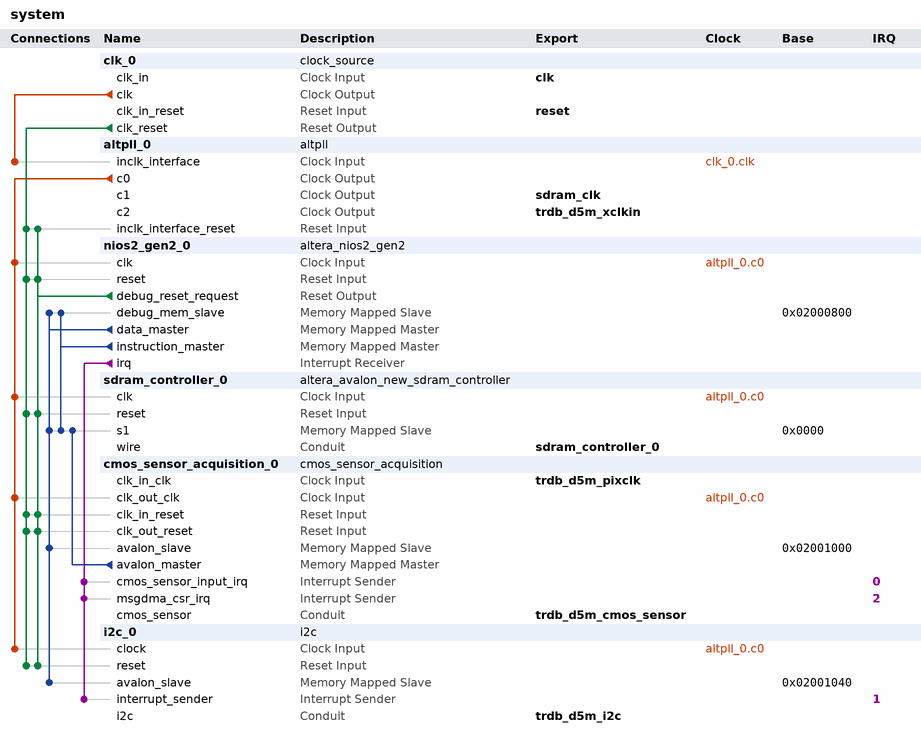
[diagram p0: system contents]
# Platform Designer (Qsys) system system, Cyclone IV E EP4CE22F17C6
# Parameters at their usual value, and those the tool derives, are not listed.
package require -exact qsys 15.1
create_system system
set_project_property DEVICE_FAMILY {Cyclone IV E}
set_project_property DEVICE EP4CE22F17C6

add_instance clk_0 clock_source 15.1
set_instance_parameter_value clk_0 clockFrequency 50000000

add_instance altpll_0 altpll 15.1
set_instance_parameter_value altpll_0 CLK0_DIVIDE_BY 1
set_instance_parameter_value altpll_0 CLK0_MULTIPLY_BY 1
set_instance_parameter_value altpll_0 CLK1_DIVIDE_BY 1
set_instance_parameter_value altpll_0 CLK1_DUTY_CYCLE 50
set_instance_parameter_value altpll_0 CLK1_MULTIPLY_BY 1
set_instance_parameter_value altpll_0 CLK1_PHASE_SHIFT -3000
set_instance_parameter_value altpll_0 CLK2_DIVIDE_BY 5
set_instance_parameter_value altpll_0 CLK2_DUTY_CYCLE 50
set_instance_parameter_value altpll_0 CLK2_MULTIPLY_BY 1
set_instance_parameter_value altpll_0 CLK2_PHASE_SHIFT 0
set_instance_parameter_value altpll_0 INCLK0_INPUT_FREQUENCY 20000
set_instance_parameter_value altpll_0 PORT_ARESET PORT_UNUSED
set_instance_parameter_value altpll_0 PORT_LOCKED PORT_UNUSED
set_instance_parameter_value altpll_0 PORT_clk1 PORT_USED
set_instance_parameter_value altpll_0 PORT_clk2 PORT_USED
set_instance_parameter_value altpll_0 PORT_clk3 PORT_UNUSED

add_instance nios2_gen2_0 altera_nios2_gen2 15.1
set_instance_parameter_value nios2_gen2_0 dcache_size 0
set_instance_parameter_value nios2_gen2_0 exceptionSlave sdram_controller_0.s1
set_instance_parameter_value nios2_gen2_0 icache_size 4096
set_instance_parameter_value nios2_gen2_0 impl Fast
set_instance_parameter_value nios2_gen2_0 resetSlave sdram_controller_0.s1

add_instance sdram_controller_0 altera_avalon_new_sdram_controller 15.1
set_instance_parameter_value sdram_controller_0 TAC 6.5
set_instance_parameter_value sdram_controller_0 TRCD 20.0
set_instance_parameter_value sdram_controller_0 TRP 20.0
set_instance_parameter_value sdram_controller_0 casLatency 2
set_instance_parameter_value sdram_controller_0 columnWidth 9
set_instance_parameter_value sdram_controller_0 dataWidth 16
set_instance_parameter_value sdram_controller_0 generateSimulationModel false
set_instance_parameter_value sdram_controller_0 initRefreshCommands 8
set_instance_parameter_value sdram_controller_0 model single_Micron_MT48LC4M32B2_7_chip
set_instance_parameter_value sdram_controller_0 numberOfBanks 4
set_instance_parameter_value sdram_controller_0 numberOfChipSelects 1
set_instance_parameter_value sdram_controller_0 powerUpDelay 200.0
set_instance_parameter_value sdram_controller_0 refreshPeriod 0.75
set_instance_parameter_value sdram_controller_0 rowWidth 13

add_instance cmos_sensor_acquisition_0 cmos_sensor_acquisition 15.1
set_instance_parameter_value cmos_sensor_acquisition_0 CLK_IN_CLOCK_FREQUENCY 10000000
set_instance_parameter_value cmos_sensor_acquisition_0 CLK_OUT_CLOCK_FREQUENCY 50000000
set_instance_parameter_value cmos_sensor_acquisition_0 CMOS_SENSOR_INPUT_DEBAYER_ENABLE false
set_instance_parameter_value cmos_sensor_acquisition_0 CMOS_SENSOR_INPUT_DEVICE_FAMILY {Cyclone IV E}
set_instance_parameter_value cmos_sensor_acquisition_0 CMOS_SENSOR_INPUT_FIFO_DEPTH 32
set_instance_parameter_value cmos_sensor_acquisition_0 CMOS_SENSOR_INPUT_MAX_HEIGHT 1944
set_instance_parameter_value cmos_sensor_acquisition_0 CMOS_SENSOR_INPUT_MAX_WIDTH 2592
set_instance_parameter_value cmos_sensor_acquisition_0 CMOS_SENSOR_INPUT_OUTPUT_WIDTH 16
set_instance_parameter_value cmos_sensor_acquisition_0 CMOS_SENSOR_INPUT_PACKER_ENABLE false
set_instance_parameter_value cmos_sensor_acquisition_0 CMOS_SENSOR_INPUT_PIX_DEPTH 12
set_instance_parameter_value cmos_sensor_acquisition_0 CMOS_SENSOR_INPUT_SAMPLE_EDGE FALLING
set_instance_parameter_value cmos_sensor_acquisition_0 DC_FIFO_DEPTH 16
set_instance_parameter_value cmos_sensor_acquisition_0 DC_FIFO_WIDTH 32
set_instance_parameter_value cmos_sensor_acquisition_0 MSGDMA_BURST_ENABLE 1
set_instance_parameter_value cmos_sensor_acquisition_0 MSGDMA_DATA_FIFO_DEPTH 64
set_instance_parameter_value cmos_sensor_acquisition_0 MSGDMA_DATA_WIDTH 32
set_instance_parameter_value cmos_sensor_acquisition_0 MSGDMA_DESCRIPTOR_FIFO_DEPTH 8
set_instance_parameter_value cmos_sensor_acquisition_0 MSGDMA_MAX_BURST_COUNT 16
set_instance_parameter_value cmos_sensor_acquisition_0 MSGDMA_MAX_BYTE 8388608

add_instance i2c_0 i2c 15.1

# connections
add_connection altpll_0.c0 cmos_sensor_acquisition_0.clk_out_clk clock
add_connection altpll_0.c0 i2c_0.clock clock
add_connection altpll_0.c0 nios2_gen2_0.clk clock
add_connection altpll_0.c0 sdram_controller_0.clk clock
add_connection clk_0.clk altpll_0.inclk_interface clock
add_connection clk_0.clk_reset altpll_0.inclk_interface_reset reset
add_connection clk_0.clk_reset cmos_sensor_acquisition_0.clk_in_reset reset
add_connection clk_0.clk_reset cmos_sensor_acquisition_0.clk_out_reset reset
add_connection clk_0.clk_reset i2c_0.reset reset
add_connection clk_0.clk_reset nios2_gen2_0.reset reset
add_connection clk_0.clk_reset sdram_controller_0.reset reset
add_connection nios2_gen2_0.debug_reset_request altpll_0.inclk_interface_reset reset
add_connection nios2_gen2_0.debug_reset_request cmos_sensor_acquisition_0.clk_in_reset reset
add_connection nios2_gen2_0.debug_reset_request cmos_sensor_acquisition_0.clk_out_reset reset
add_connection nios2_gen2_0.debug_reset_request i2c_0.reset reset
add_connection nios2_gen2_0.debug_reset_request nios2_gen2_0.reset reset
add_connection nios2_gen2_0.debug_reset_request sdram_controller_0.reset reset
add_connection cmos_sensor_acquisition_0.avalon_master sdram_controller_0.s1 avalon
set_connection_parameter_value cmos_sensor_acquisition_0.avalon_master/sdram_controller_0.s1 baseAddress 0x0000
add_connection nios2_gen2_0.data_master cmos_sensor_acquisition_0.avalon_slave avalon
set_connection_parameter_value nios2_gen2_0.data_master/cmos_sensor_acquisition_0.avalon_slave baseAddress 0x02001000
add_connection nios2_gen2_0.data_master i2c_0.avalon_slave avalon
set_connection_parameter_value nios2_gen2_0.data_master/i2c_0.avalon_slave baseAddress 0x02001040
add_connection nios2_gen2_0.data_master nios2_gen2_0.debug_mem_slave avalon
set_connection_parameter_value nios2_gen2_0.data_master/nios2_gen2_0.debug_mem_slave baseAddress 0x02000800
add_connection nios2_gen2_0.data_master sdram_controller_0.s1 avalon
set_connection_parameter_value nios2_gen2_0.data_master/sdram_controller_0.s1 baseAddress 0x0000
add_connection nios2_gen2_0.instruction_master nios2_gen2_0.debug_mem_slave avalon
set_connection_parameter_value nios2_gen2_0.instruction_master/nios2_gen2_0.debug_mem_slave baseAddress 0x02000800
add_connection nios2_gen2_0.instruction_master sdram_controller_0.s1 avalon
set_connection_parameter_value nios2_gen2_0.instruction_master/sdram_controller_0.s1 baseAddress 0x0000
add_connection nios2_gen2_0.irq cmos_sensor_acquisition_0.cmos_sensor_input_irq interrupt
set_connection_parameter_value nios2_gen2_0.irq/cmos_sensor_acquisition_0.cmos_sensor_input_irq irqNumber 0
add_connection nios2_gen2_0.irq cmos_sensor_acquisition_0.msgdma_csr_irq interrupt
set_connection_parameter_value nios2_gen2_0.irq/cmos_sensor_acquisition_0.msgdma_csr_irq irqNumber 2
add_connection nios2_gen2_0.irq i2c_0.interrupt_sender interrupt
set_connection_parameter_value nios2_gen2_0.irq/i2c_0.interrupt_sender irqNumber 1

# exported interfaces
add_interface clk clock sink
set_interface_property clk EXPORT_OF clk_0.clk_in
add_interface reset reset sink
set_interface_property reset EXPORT_OF clk_0.clk_in_reset
add_interface sdram_clk clock source
set_interface_property sdram_clk EXPORT_OF altpll_0.c1
add_interface sdram_controller_0 conduit end
set_interface_property sdram_controller_0 EXPORT_OF sdram_controller_0.wire
add_interface trdb_d5m_cmos_sensor conduit end
set_interface_property trdb_d5m_cmos_sensor EXPORT_OF cmos_sensor_acquisition_0.cmos_sensor
add_interface trdb_d5m_i2c conduit end
set_interface_property trdb_d5m_i2c EXPORT_OF i2c_0.i2c
add_interface trdb_d5m_pixclk clock sink
set_interface_property trdb_d5m_pixclk EXPORT_OF cmos_sensor_acquisition_0.clk_in_clk
add_interface trdb_d5m_xclkin clock source
set_interface_property trdb_d5m_xclkin EXPORT_OF altpll_0.c2

set_interconnect_requirement {$system} qsys_mm.clockCrossingAdapter HANDSHAKE
set_interconnect_requirement {$system} qsys_mm.enableEccProtection FALSE
set_interconnect_requirement {$system} qsys_mm.insertDefaultSlave FALSE
set_interconnect_requirement {$system} qsys_mm.maxAdditionalLatency 1

save_system system.qsys
